# EAGLE design first try (EAGLE 9.6.2)
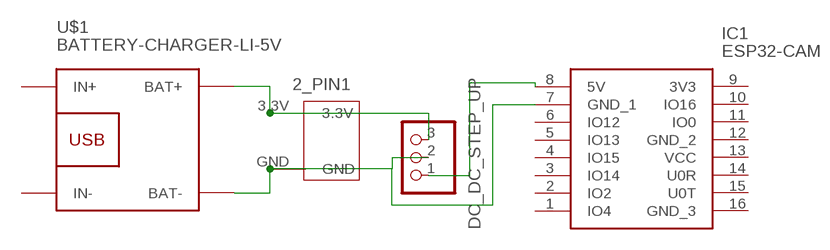
[diagram p0: schematic, sheet 1]

## Parts
2_PIN1  2_PIN_HEADER  [2_PIN_HEADER]
DC_DC_STEP_UP  PINHD-1X3  [1X03]
IC1  ESP32-CAM  [ESP32CAM]
U$1  BATTERY-CHARGER-LI-5V  [BATTERY-CHARGER-LI-5V]

## Nets
N$1: 2_PIN1.GND DC_DC_STEP_UP.2 IC1.7(GND_1) U$1.BAT-
N$2: 2_PIN1.3.3V DC_DC_STEP_UP.3 U$1.BAT+
N$5: DC_DC_STEP_UP.1 IC1.8(5V)
Unconnected: IC1.1(IO4) IC1.2(IO2) IC1.3(IO14) IC1.4(IO15) IC1.5(IO13) IC1.6(IO12) IC1.9(3V3) IC1.10(IO16) IC1.11(IO0) IC1.12(GND_2) IC1.13(VCC) IC1.14(U0R) IC1.15(U0T) IC1.16(GND_3) U$1.IN+ U$1.IN-

## Library data of the parts
2_PIN1 = 2_pin:2_PIN_HEADER
DC_DC_STEP_UP = pinhead:PINHD-1X3: PIN HEADER
IC1 = ESP32-CAM:ESP32-CAM: Modules PCBA Module RoHS Source: Datasheet <https://datasheet.lcsc.com/szlcsc/Ai-Thinker-ESP32-CAM_C277946.pdf>; DESCRIPTION: Modules PCBA Module RoHS; HEIGHT: 5mm; MANUFACTURER_NAME: Ai-Thinker; MANUFACTURER_PART_NUMBER: ESP32-CAM
U$1 = diy-modules:BATTERY-CHARGER-LI-5V: Lithium Battery 5V Charger More details available here: http://www.buildcircuit.com/how-to-use-micro-usb-5v-1a-lithium-battery-charging-board-charger-module/ Click here to find device on ebay.com <http://www.ebay.com/sch/tp4056+charger+usb>

## Board
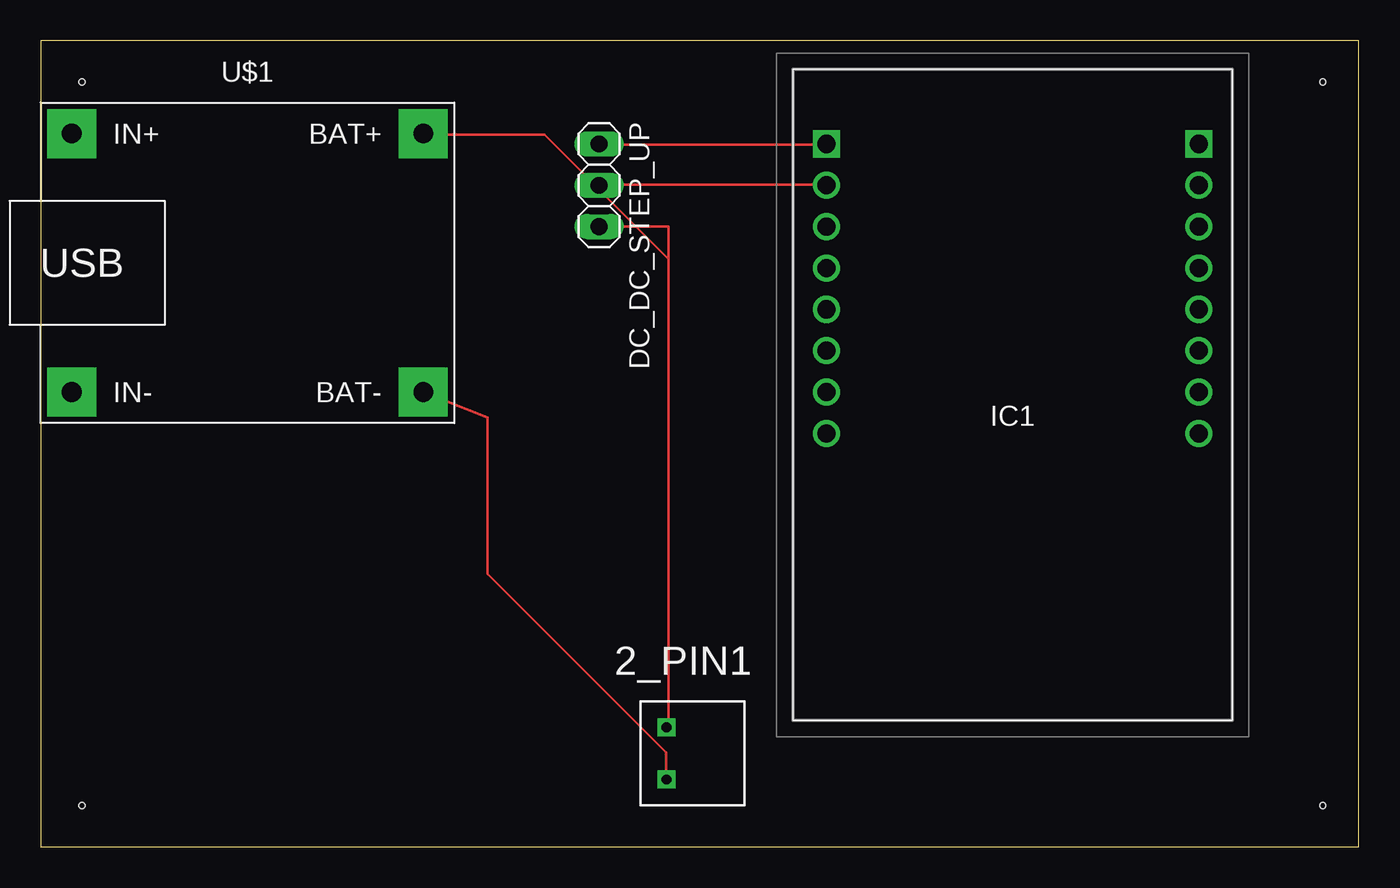
[diagram p1: board, top side]
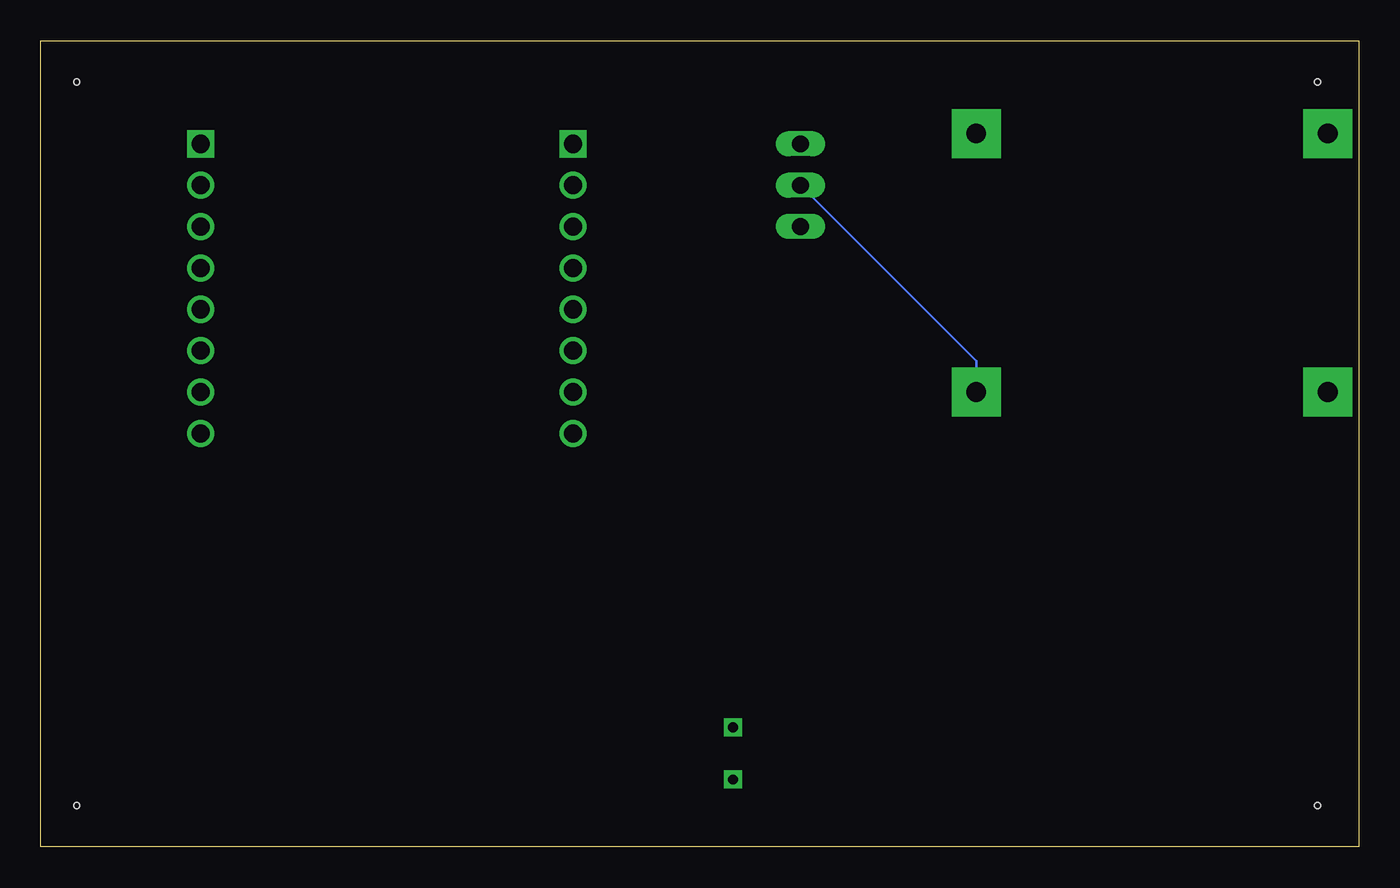
[diagram p2: board, bottom side, seen from below]

Size 80.95 x 49.52 mm. Coordinates in mm from the lower left corner, seen from the top.
Outline: 0,0 80.95,0 80.95,49.52 0,49.52 0,0
Copper layers (1*16): Top 0.035mm / dielectric 1.5mm / Bottom 0.035mm
Design rules "default": minimum track width 6mil, minimum drill 0.35mm, track to track 6mil, track to pad 6mil, pad to pad 6mil, via to via 6mil, smd to smd 6mil, copper to edge 40mil, drill to drill 6mil, minimum pad ring 10mil, minimum via ring 8mil, stop-mask expansion 4mil, vias tented up to drill 0mil, thermal gap 10mil
Holes 0.35 mm at 2.54,46.99 2.54,2.54 78.74,2.54 78.74,46.99

### Footprints (pad centres in the part's own frame; a part is rotated, then mirrored left to right if it is on the bottom)
2_PIN_HEADER = drill 0.6 square: 3.3V 1.6,4.8; GND 1.6,1.6
1X03 = drill 1.016 long: 1 -2.54,0; 2 0,0; 3 2.54,0
ESP32CAM = drill 1.11 pad 1.665: 1 0,0; 2 0,2.54; 3 0,5.08; 4 0,7.62; 5 0,10.16; 6 0,12.7; 7 0,15.24; 10 22.86,15.24; 11 22.86,12.7; 12 22.86,10.16; 13 22.86,7.62; 14 22.86,5.08; 15 22.86,2.54; 16 22.86,0 | drill 1.11 pad 1.665 square: 8 0,17.78; 9 22.86,17.78
BATTERY-CHARGER-LI-5V = drill 1.2 pad 3 square: BAT+ 10.795,8.255; BAT- 10.795,-7.62; IN+ -10.795,8.255; IN- -10.795,-7.62

### Placement (x,y rotation side)
2_PIN1  36.83,2.54 0 top
DC_DC_STEP_UP  34.29,40.64 270 top
IC1  48.26,25.4 0 top
U$1  12.7,35.56 0 top

### Tracks (layer width: path | path; a pad name or v marks a point on that pad's centre or on a via)
N$1
  Top 0.152: DC_DC_STEP_UP.2 34.34,40.69 48.16,40.69 IC1.7 | 2_PIN1.GND 38.41,4.27 38.41,5.79 27.43,16.76 27.43,26.36 U$1.BAT-
  Bottom 0.152: U$1.BAT- 23.5,29.85 DC_DC_STEP_UP.2
N$2
  Top 0.152: 38.56,36.12 38.56,7.47 2_PIN1.3.3V | DC_DC_STEP_UP.3 38.56,38.1 38.56,36.12 | 38.56,36.12 30.94,43.74 23.62,43.74 U$1.BAT+
N$5
  Top 0.152: DC_DC_STEP_UP.1 34.34,43.13 48.16,43.13 IC1.8